# EAGLE design HF091CBU (EAGLE 9.6.1)

## Sheet 1 of 2
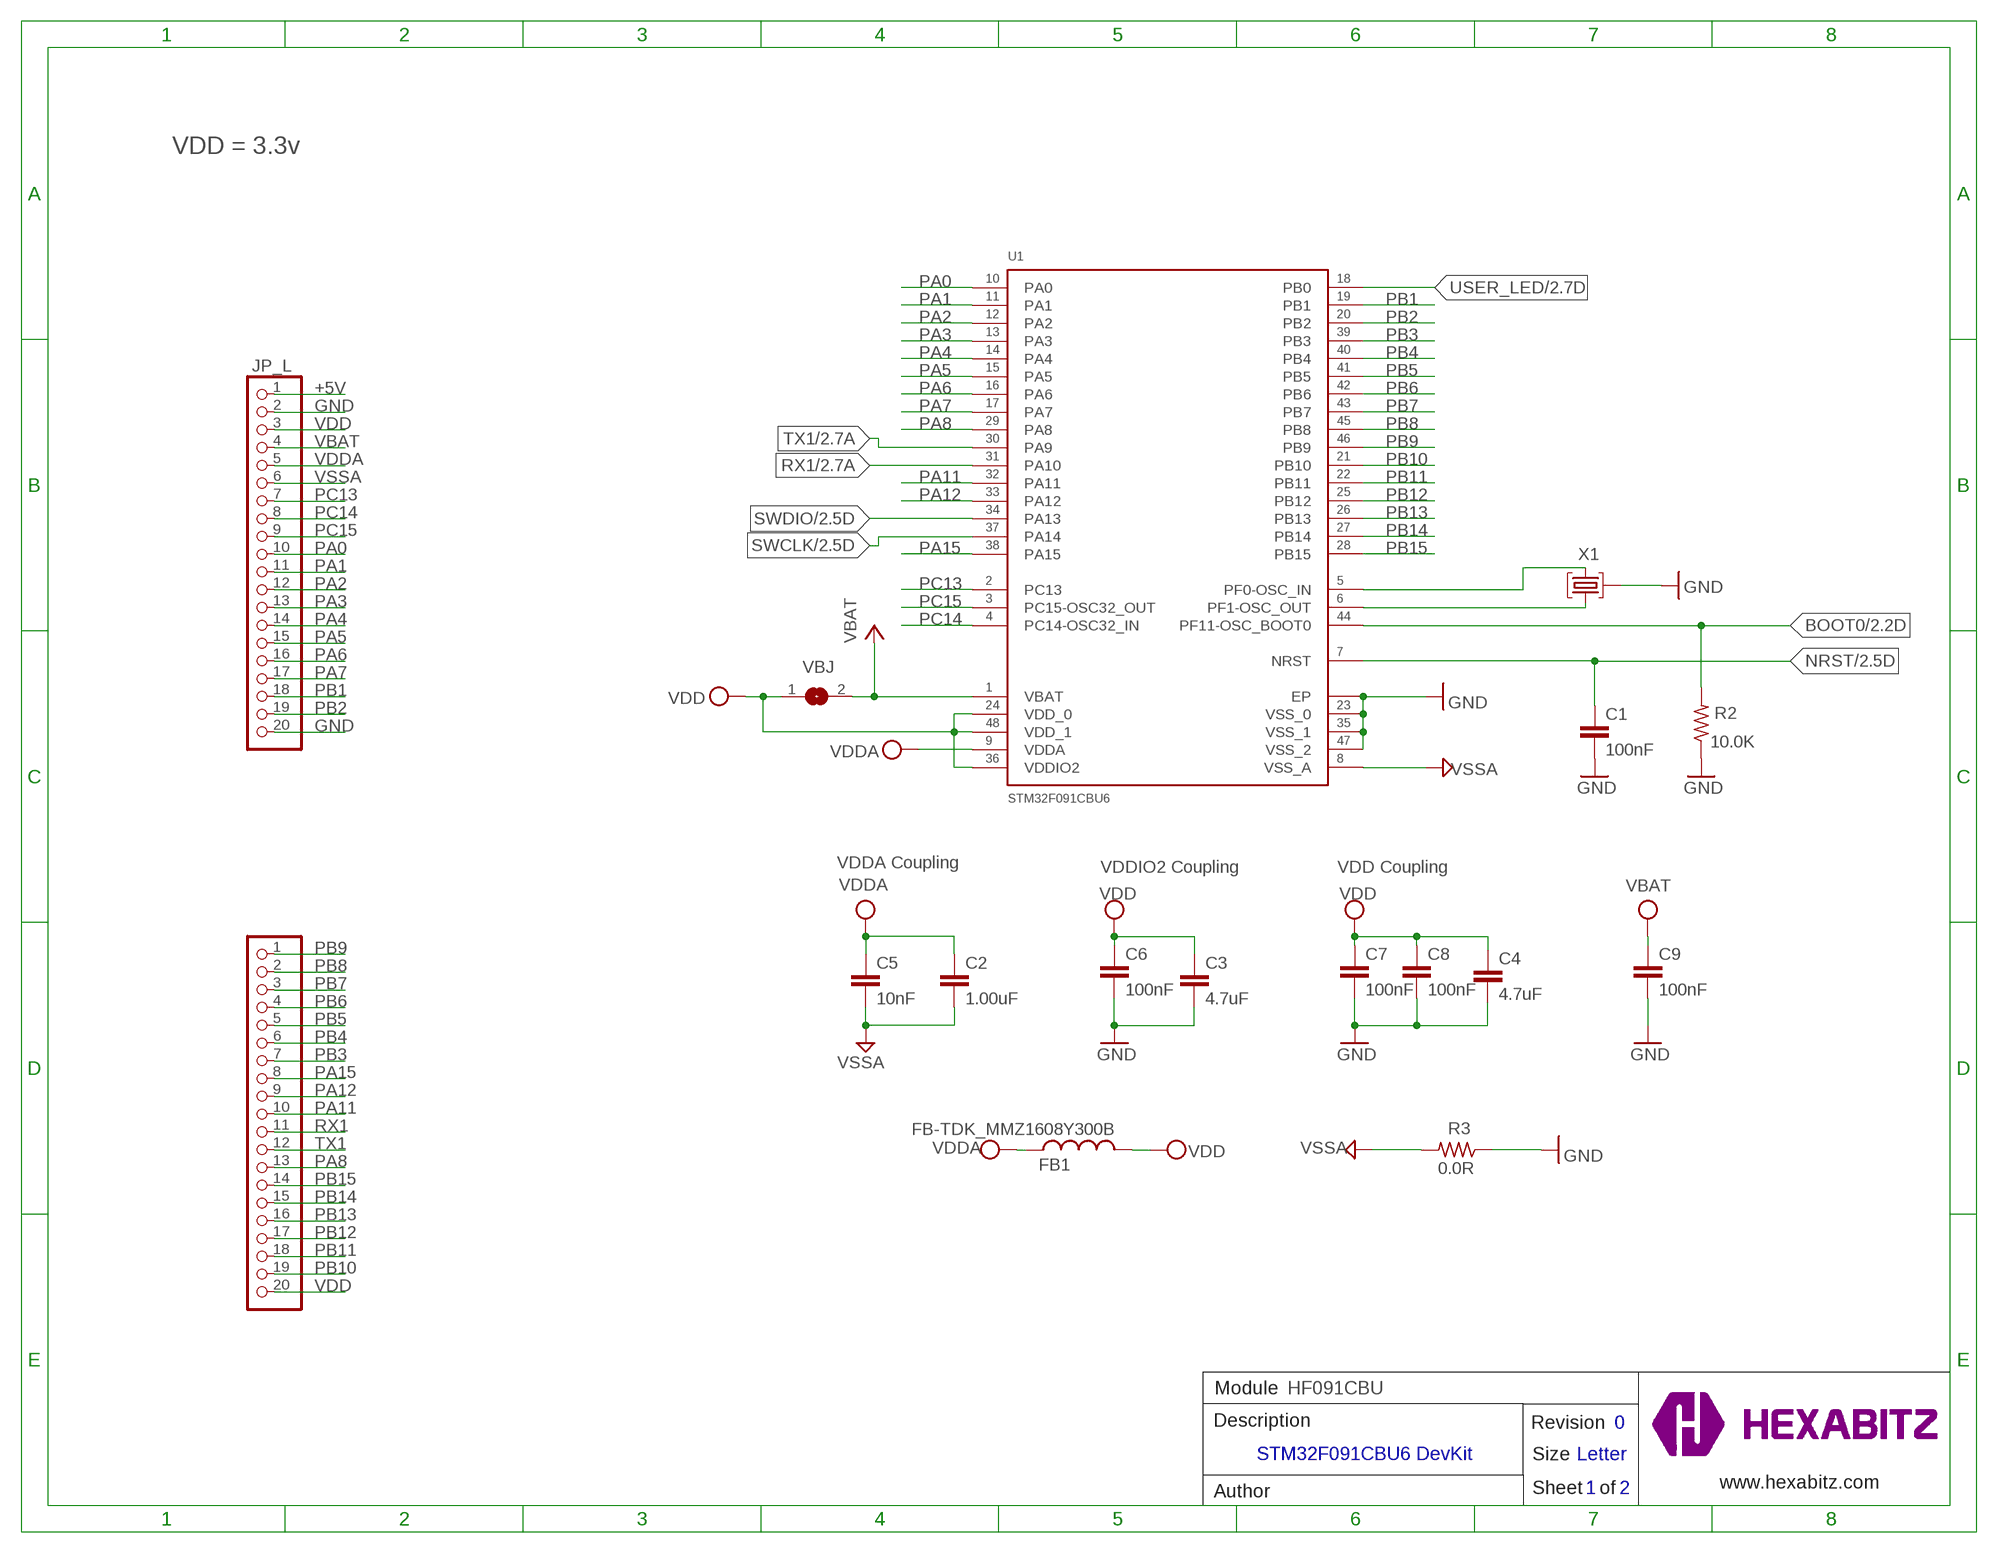
[diagram p0: schematic, sheet 1]

### Parts
C1  100nF  C-0603  [C-0603]
C2  1.00uF  C-0805  [C-0805]
C3  4.7uF  C-0805  [C-0805]
C4  4.7uF  C-0805  [C-0805]
C5  10nF  C-0603  [C-0603]
C6  100nF  C-0603  [C-0603]
C7  100nF  C-0603  [C-0603]
C8  100nF  C-0603  [C-0603]
C9  100nF  C-0603  [C-0603]
FB1  FB-TDK_MMZ1608Y300B  FB-0603  [FB-0603]
JP_L  PINHD-1X20  [1X20]
JP_R  PINHD-1X20  [1X20]
R2  10.0K  R-0603  [R-0603]
R3  0.0R  R-0603  [R-0603]
U1  STM32F091CBU6  [STM32F091CBU6]
VBJ  SJ  [SJ]
X1  XTALL_CSTCE8M00G52  [XTALL_CSTCE8M00G52]

### Nets
+5V: JP_L.1 ; also sheet 2
BOOT0: R2.2 U1.P$44(PF11-OSC_BOOT0) ; also sheet 2
GND: C1.2 C3.2 C4.2 C6.2 C7.2 C8.2 C9.2 JP_L.2 JP_L.20 R2.1 R3.1 U1.EP U1.P$23(VSS_0) U1.P$35(VSS_1) U1.P$47(VSS_2) X1.P$2 ; also sheet 2
N$5: U1.P$5(PF0-OSC_IN) X1.P$1
N$6: U1.P$6(PF1-OSC_OUT) X1.P$3
NRST: C1.1 U1.P$7(NRST) ; also sheet 2
PA0: JP_L.10 U1.P$10(PA0)
PA1: JP_L.11 U1.P$11(PA1)
PA2: JP_L.12 U1.P$12(PA2)
PA3: JP_L.13 U1.P$13(PA3)
PA4: JP_L.14 U1.P$14(PA4)
PA5: JP_L.15 U1.P$15(PA5)
PA6: JP_L.16 U1.P$16(PA6)
PA7: JP_L.17 U1.P$17(PA7)
PA8: JP_R.13 U1.P$29(PA8)
PA11: JP_R.10 U1.P$32(PA11)
PA12: JP_R.9 U1.P$33(PA12)
PA15: JP_R.8 U1.P$38(PA15)
PB1: JP_L.18 U1.P$19(PB1)
PB2: JP_L.19 U1.P$20(PB2)
PB3: JP_R.7 U1.P$39(PB3)
PB4: JP_R.6 U1.P$40(PB4)
PB5: JP_R.5 U1.P$41(PB5)
PB6: JP_R.4 U1.P$42(PB6)
PB7: JP_R.3 U1.P$43(PB7)
PB8: JP_R.2 U1.P$45(PB8)
PB9: JP_R.1 U1.P$46(PB9)
PB10: JP_R.19 U1.P$21(PB10)
PB11: JP_R.18 U1.P$22(PB11)
PB12: JP_R.17 U1.P$25(PB12)
PB13: JP_R.16 U1.P$26(PB13)
PB14: JP_R.15 U1.P$27(PB14)
PB15: JP_R.14 U1.P$28(PB15)
PC13: JP_L.7 U1.P$2(PC13)
PC14: JP_L.8 U1.P$3(PC14-OSC32_IN)
PC15: JP_L.9 U1.P$4(PC15-OSC32_OUT)
RX1: JP_R.11 U1.P$31(PA10) ; also sheet 2
SWCLK: U1.P$37(PA14) ; also sheet 2
SWDIO: U1.P$34(PA13) ; also sheet 2
TX1: JP_R.12 U1.P$30(PA9) ; also sheet 2
USER_LED: U1.P$18(PB0) ; also sheet 2
VBAT: C9.1 JP_L.4 U1.P$1(VBAT) VBJ.2 ; supply symbol labelled VDDA
VDD: C3.1 C4.1 C6.1 C7.1 C8.1 FB1.2 JP_L.3 JP_R.20 U1.P$24(VDD_0) U1.P$36(VDDIO2) U1.P$48(VDD_1) VBJ.1 ; also sheet 2
VDDA: C2.1 C5.1 FB1.1 JP_L.5 U1.P$9(VDDA)
VSSA: C2.2 C5.2 JP_L.6 R3.2 U1.P$8(VSS_A)

### Notes on the sheet
- VDD = 3.3v
- VDDA Coupling | VDDIO2 Coupling | VDD Coupling
- Module | HF091CBU
- Description | Revision | 0
- STM32F091CBU6 DevKit
- Size | Letter
- www.hexabitz.com
- Author | Sheet   of | 1 | 2
- C:/Users/Admin/Desktop/logodraft.bmp

## Sheet 2 of 2
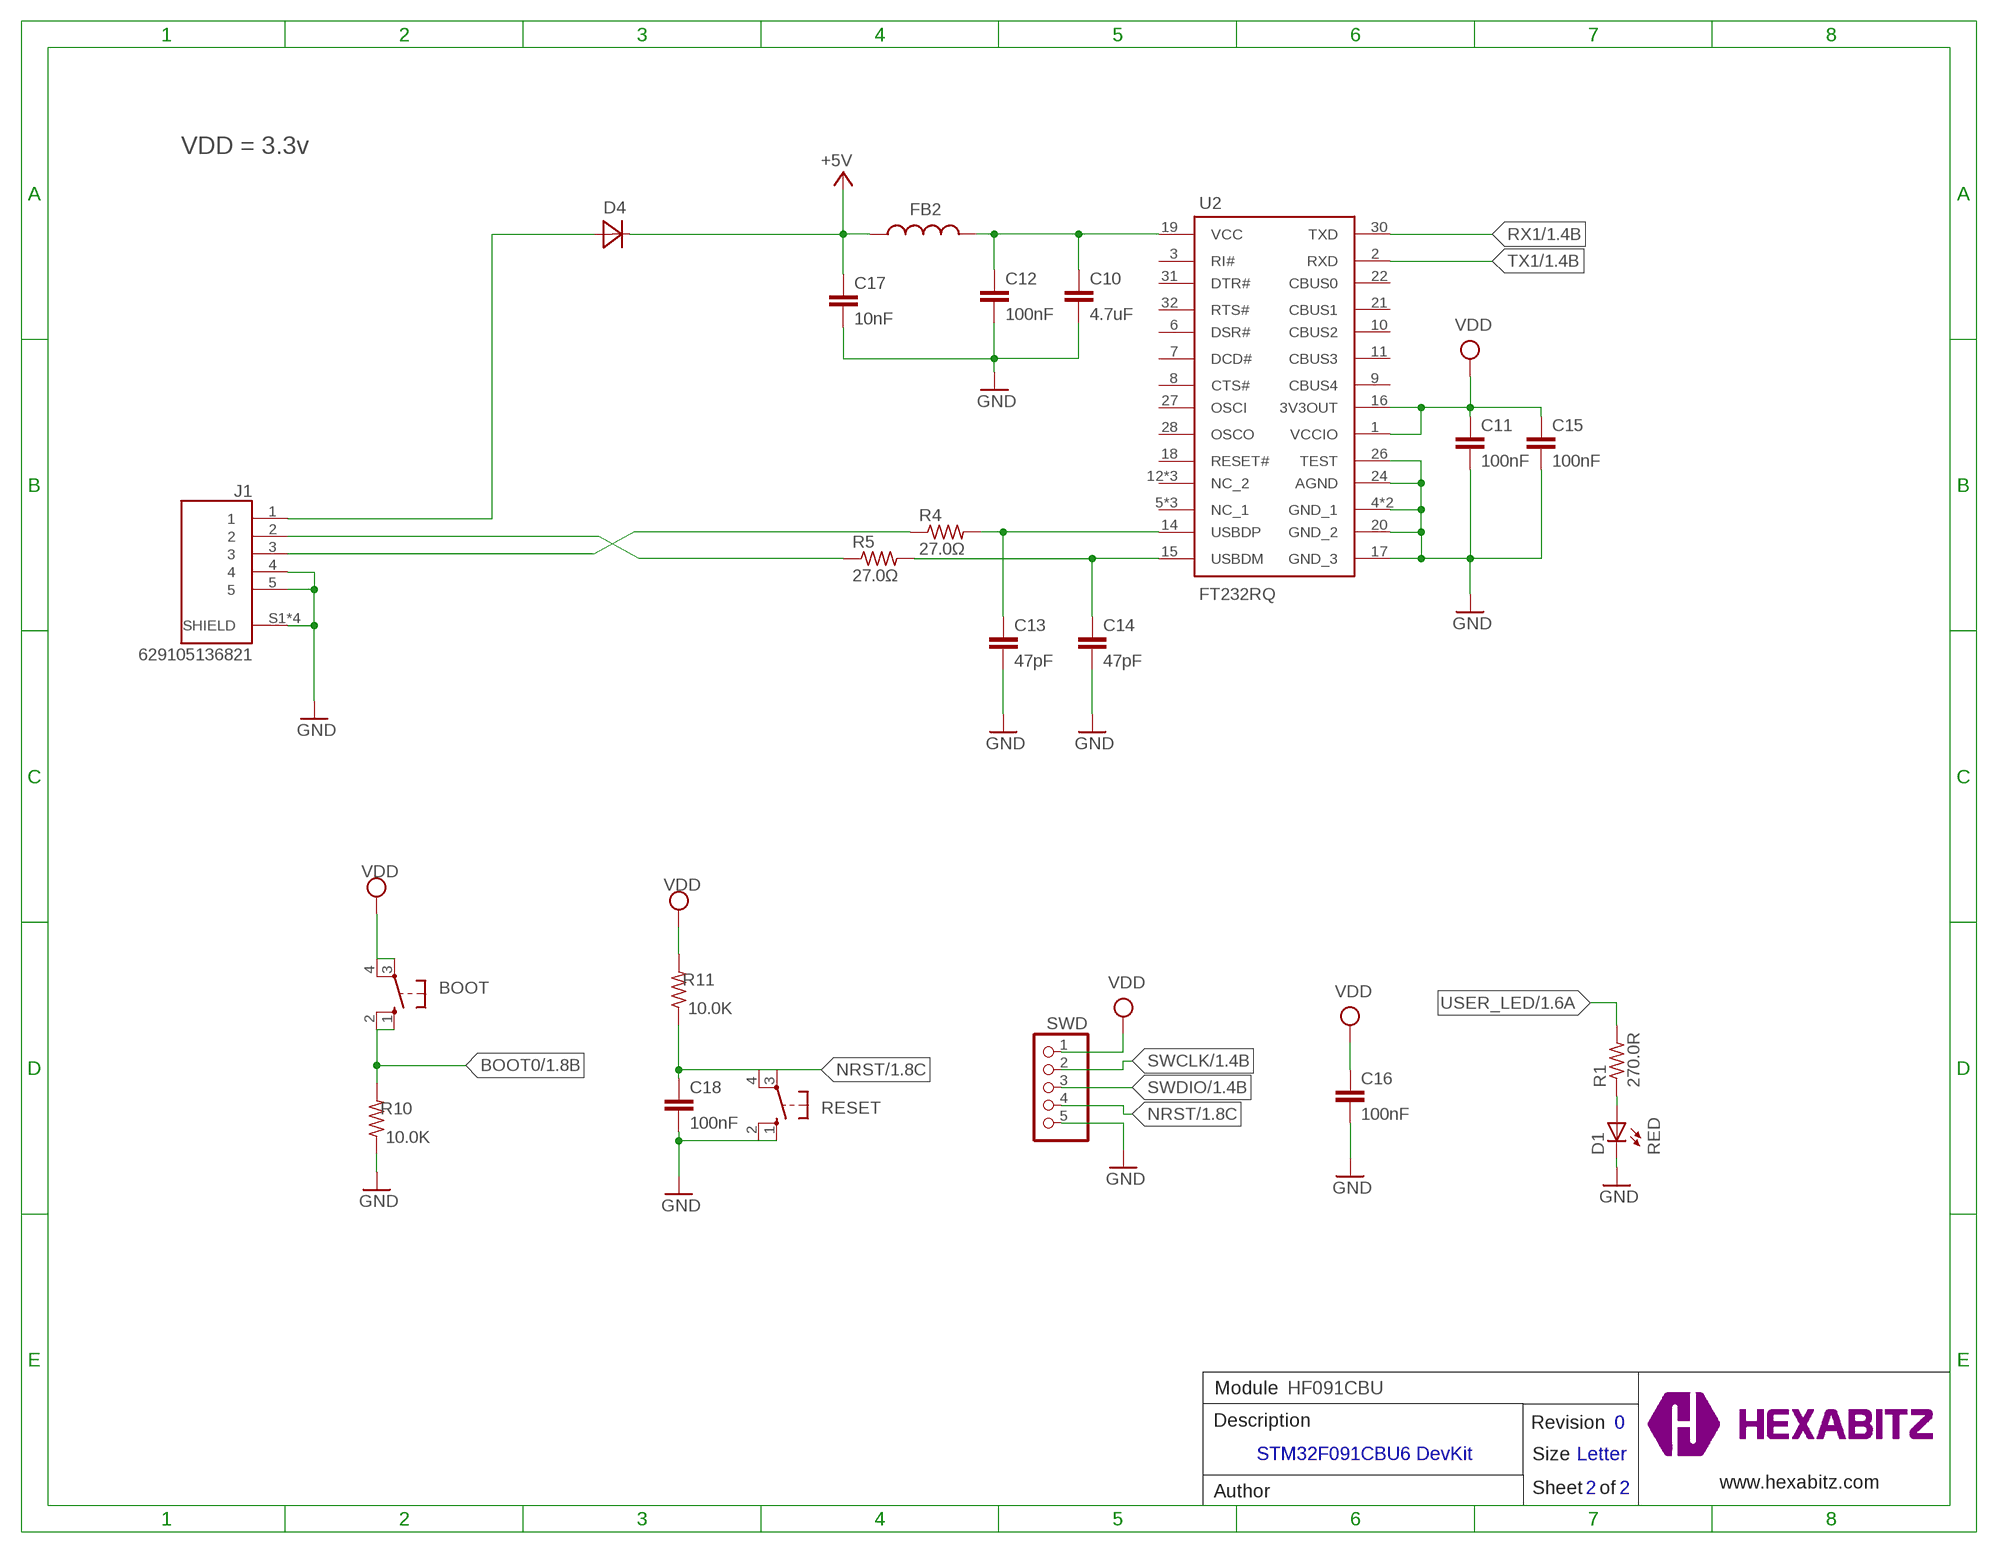
[diagram p1: schematic, sheet 2]

### Parts
BOOT  10-XX  [B3F-10XX]
C10  4.7uF  C-0805  [C-0805]
C11  100nF  C-0603  [C-0603]
C12  100nF  C-0603  [C-0603]
C13  47pF  C-0603  [C-0603]
C14  47pF  C-0603  [C-0603]
C15  100nF  C-0603  [C-0603]
C16  100nF  C-0603  [C-0603]
C17  10nF  C-0603  [C-0603]
C18  100nF  C-0603  [C-0603]
D1  RED  VLMS1300-GS08  [VLMS1300-GS08]
D4  DIOD-SOD-123  [SOD123]
FB2  FB-TDK_MMZ1608Y300B  FB-0603  [FB-0603]
J1  629105136821  [WE_629105136821]
R1  270.0R  R-0603  [R-0603]
R4  27.0Ω  R-0603  [R-0603]
R5  27.0Ω  R-0603  [R-0603]
R10  10.0K  R-0603  [R-0603]
R11  10.0K  R-0603  [R-0603]
RESET  10-XX  [B3F-10XX]
SWD  PINHD-1X5/90  [1X05/90]
TRIMBLE-LOGO1  HEXABITZ-LOGO_NO_BOTTOM_SPLIT  [HEXABITZ-LOGO_NO_BOTTOM_SPLIT]
U2  FT232RQ  [QFN50P500X500X90-33N]

### Nets
+5V: C17.1 D4.2(C) FB2.1 ; also sheet 1
BOOT0: BOOT.1(S) BOOT.2(S1) R10.2 ; also sheet 1
GND: C10.2 C11.2 C12.2 C13.2 C14.2 C15.2 C16.2 C17.2 C18.2 D1.C J1.4 J1.5 J1.S1(SHIELD) J1.S2(SHIELD) J1.S3(SHIELD) J1.S4(SHIELD) R10.1 RESET.1(S) RESET.2(S1) SWD.5 U2.4(GND_1) U2.17(GND_3) U2.20(GND_2) U2.24(AGND) U2.26(TEST) U2.33(GND_1) ; also sheet 1
N$1: D4.1(A) J1.1
N$2: C10.1 C12.1 FB2.2 U2.19(VCC)
N$4: D1.A R1.1
NRST: C18.1 R11.1 RESET.3(P) RESET.4(P1) SWD.4 ; also sheet 1
RX1: U2.30(TXD) ; also sheet 1
SWCLK: SWD.2 ; also sheet 1
SWDIO: SWD.3 ; also sheet 1
TX1: U2.2(RXD) ; also sheet 1
USB_N: J1.2 R5.1
USB_P: J1.3 R4.1
USBD_N: C14.1 R5.2 U2.15(USBDM)
USBD_P: C13.1 R4.2 U2.14(USBDP)
USER_LED: R1.2 ; also sheet 1
VDD: BOOT.3(P) BOOT.4(P1) C11.1 C15.1 C16.1 R11.2 SWD.1 U2.1(VCCIO) U2.16(3V3OUT) ; also sheet 1
Unconnected: U2.3(RI#) U2.5(NC_1) U2.6(DSR#) U2.7(DCD#) U2.8(CTS#) U2.9(CBUS4) U2.10(CBUS2) U2.11(CBUS3) U2.12(NC_2) U2.13(NC_2) U2.18(RESET#) U2.21(CBUS1) U2.22(CBUS0) U2.23(NC_1) U2.25(NC_1) U2.27(OSCI) U2.28(OSCO) U2.29(NC_2) U2.31(DTR#) U2.32(RTS#)

### Notes on the sheet
- VDD = 3.3v
- Module | HF091CBU
- Description | Revision | 0
- STM32F091CBU6 DevKit
- Size | Letter
- www.hexabitz.com
- Author | Sheet   of | 2 | 2

## Library data of the parts
BOOT RESET = switch-omron:10-XX: OMRON SWITCH; MPN: B3F-1000; OC_FARNELL: 176432; OC_NEWARK: 36M3542
C1 C6 C8 C16 C18 = HEXABITZ_RCLS:C-0603: CAP CER 10% X7R 0603; CAPACITANCE: 100nF; MFN: KEMET; MPN: C0603C104K8RACTU; OCTOPART_URL: https://octopart.com/c0603c104k8ractu-kemet-145075?r=sp&s=9bS9ASSwSEqMCE9KBEQZ0g; TOLERANCE: 10%; VOLTAGE_RATING: 10V
C2-C4 C10 = HEXABITZ_RCLS:C-0805: CAP CER 10% X7R 0805
C5 = HEXABITZ_RCLS:C-0603: CAP CER 10% X7R 0603; CAPACITANCE: 10nF; MFN: KEMET; MPN: C0603C103K5RACTU; OCTOPART_URL: https://octopart.com/c0603c103k5ractu-kemet-133094?r=sp&s=R_iPBxLnSmGqhkU2rIMFpg; TOLERANCE: 10%; VOLTAGE_RATING: 50V
C7 = HEXABITZ_RCLS:C-0603: CAP CER 10% X7R 0603; CAPACITANCE: 100nF; MFN: KEMET; MPN: C0603C104K8RACTU; OCTOPART_URL: https://octopart.com/c0603c104k8ractu-kemet-145075?r=sp&s=9bS9ASSwSEqMCE9KBEQZ0g; TOLERANCE: 10%; VOLTAGE_RATING: 10
C9 = HEXABITZ_RCLS:C-0603: CAP CER 10% X7R 0603; CAPACITANCE: 100nF; MFN: KEMET; MPN: C0603C104K8RACTU; OCTOPART_URL: https://octopart.com/c0603c104k8ractu-kemet-145075?r=sp&s=9bS9ASSwSEqMCE9KBEQZ0g; TOLERANCE: 10V; VOLTAGE_RATING: 10%
C11 C12 C15 C17 = HEXABITZ_RCLS:C-0603: CAP CER 10% X7R 0603; CAPACITANCE: 100 nF; MFN: AVX; MPN: 0603YC104K4T2A; OCTOPART_URL: https://octopart.com/0603yc104k4t2a-avx+interconnect+%2F+elco-8120651; TOLERANCE: ±10%; VOLTAGE_RATING: 16.0 V
C13 = HEXABITZ_RCLS:C-0603: CAP CER 10% X7R 0603; CAPACITANCE: 47 pF; MFN: AVX; MPN: 06035A470JAT2A; OCTOPART_URL: https://octopart.com/c3225x5r0j107m250ac-tdk-25947844?r=spc#; TOLERANCE: ±5%; VOLTAGE_RATING: 50.0 V
C14 = HEXABITZ_RCLS:C-0603: CAP CER 10% X7R 0603; CAPACITANCE: 47 pF; MFN: AVX; MPN: 06035A470JAT2A; OCTOPART_URL: https://octopart.com/06035a470jat2a-avx+interconnect+%2F+elco-46507018; TOLERANCE: ±5%; VOLTAGE_RATING: 50.0 V
D1 = Hexabitz:VLMS1300-GS08: Red 0603 130° Clear 54 mcd 2 V Surface Mount ChipLED ; Octopart Url : http://octopart.com/vlms1300-gs08-vishay-21709201; MFN: Vishay; MPN: VLMS1300-GS08; OCTOPART_URL: https://octopart.com/vlms1300-gs08-vishay-21709201?r=sp&s=_gcP4_q8T1SC6PJQPTQ9yA
D4 = HEXABITZ_RCLS:DIOD-SOD-123: 1.0 A Surface Mount Schottky Barrier Rectifier, 40 V, -65 to 125 degC, 2-Pin SOD-123 Package, RoHS, Tape and Reel
FB1 FB2 = HEXABITZ_RCLS:FB-0603: Ferrite Beads Multi-Layer 0603; MFN: TDK; MPN: MMZ1608Y300B; OCTOPART_URL: https://octopart.com/mmz1608y300b-tdk-368280?r=sp&s=cd9_2ZEqQ9q9UNBuQgHAiA
J1 = HEXABITZ_CONNECTION_PARTS:629105136821: WR-COM SMT Horizontal 5 Contacts Micro USB Type B,5 pins Check availability <https://pricing.snapeda.com/parts/629105136821/W%C3%BCrth%20Elektronik/view-part?ref=eda>; AVAILABILITY: In Stock; DESCRIPTION: USB - micro B USB 2.0 Receptacle Connector 5 Position Surface Mount, Right Angle; MF: Würth Elektronik; MP: 629105136821; PACKAGE: None; PRICE: None; PURCHASE-URL: https://pricing.snapeda.com/search/part/629105136821/?ref=eda
JP_L JP_R = HEXABITZ_USER_INTERFACE_PARTS:PINHD-1X20: PIN HEADER
R1 = HEXABITZ_RCLS:R-0603: Thick Film Resistors - SMD 0603; MFN: Yageo; MPN: RC0603FR-07270RL; OCTOPART_URL: https://octopart.com/search?q=RC0603FR-07270RL&start=0; RESISTANCE: 270.0 Ohm; TOLERANCE: 1%
R2 = HEXABITZ_RCLS:R-0603: Thick Film Resistors - SMD 0603; MFN: Vishay; MPN: CRCW060310K0JNEB; OCTOPART_URL: https://octopart.com/crcw060310k0jneb-vishay+dale-46603268; RESISTANCE: 10.0K Ohm; TOLERANCE: 5%
R3 = HEXABITZ_RCLS:R-0603: Thick Film Resistors - SMD 0603; MFN: Yageo; MPN: RC0603JR-070RL; OCTOPART_URL: https://octopart.com/rc0603jr-070rl-yageo-1241539?r=sp&s=X2NteqRjRNWrnx42Y0aliA
R4 R5 = HEXABITZ_RCLS:R-0603: Thick Film Resistors - SMD 0603; MFN: Vishay; MPN: CRCW060327R0FKEA; OCTOPART_URL: https://octopart.com/crcw060327r0fkea-vishay-39833156; RESISTANCE: 27.0 Ω; TOLERANCE: ±1%
R10 R11 = HEXABITZ_RCLS:R-0603: Thick Film Resistors - SMD 0603; MFN: Yageo; MPN: RC0603JR-0710KL; OCTOPART_URL: https://octopart.com/search?q=RC0603JR-0710KL&start=0; RESISTANCE: 10.0K Ohm; TOLERANCE: 5%
SWD = HEXABITZ_USER_INTERFACE_PARTS:PINHD-1X5: PIN HEADER
TRIMBLE-LOGO1 = HEXABITZ_USER_INTERFACE_PARTS:HEXABITZ-LOGO_NO_BOTTOM_SPLIT: Trimble-Logo
U1 = Hexabitz:STM32F091CBU6: Description : ARM-based 32-bit MCU, CAN, 12 timers, ADC, DAC & Comm. Interface, 2 to 3.6 V, -40 to 85 degC, 48-Pin UFQFPN, RoHS, Tray ;Parameter : Ciiva URL : https://ciiva.com/part/STM32F091CBU6-20240708, CiivaID : 20240708, Clock Speed : 48000000.0 Hz, Lifecycle Status : Active, Mounting Style : Surface Mount, Number of Pins : 48, Octopart Url : https://octopart.com/stm32f091cbu6-stmicroelectronics-51988677, OctopartID : 5f4f955c32ec8088, RAM Memory Size : 32768 B, REACH SVHC Compliance : No SVHC, RoHS : Compliant,; MFN: STMicroelectronics; MPN: STM32F091CBU6; OCTOPART_URL: https://octopart.com/stm32f091cbu6-stmicroelectronics-51988677?r=sp&s=bU6fpgsrTZOxHyt7jkfh3w
U2 = HEXABITZ_ICs:FT232RQ: USB-to-UART 1-CH 256Byte FIFO 5V 32-Pin QFN EP Check availability <https://pricing.snapeda.com/parts/FT232RQ/FTDI%2C%20Future/view-part?ref=eda> Check availability <https://pricing.snapeda.com/parts/FT232RQ/FTDI%2C%20Future/view-part?ref=eda>; AVAILABILITY: In Stock; CHECK_PRICES: https://www.snapeda.com/parts/FT232RQ/FTDI%252C+Future+Technology+Devices+International+Ltd/view-part/?ref=eda; DESCRIPTION: USB Bridge, USB to UART USB 2.0 UART Interface 32-QFN (5x5); MF: FTDI, Future; MP: FT232RQ; PACKAGE: QFN-32 FTDI; PRICE: None; SNAPEDA_LINK: https://www.snapeda.com/parts/FT232RQ/FTDI%252C+Future+Technology+Devices+International+Ltd/view-part/?ref=snap
VBJ = jumper:SJ: SMD solder JUMPER
X1 = Hexabitz:XTALL_CSTCE8M00G52: MURATA CSTCE8M00G52-R0 RESONATOR, SMD, 8MHZ ; Octopart Url : https://octopart.com/cstce8m00g52-r0-murata-7145559; MFN: Murata; MPN: CSTCE8M00G52Z-R0; OCTOPART_URL: https://octopart.com/cstce8m00g52z-r0-murata-17755941?r=sp&s=JDnNJnrHQhyS8Zk4ofFWXw

## Board
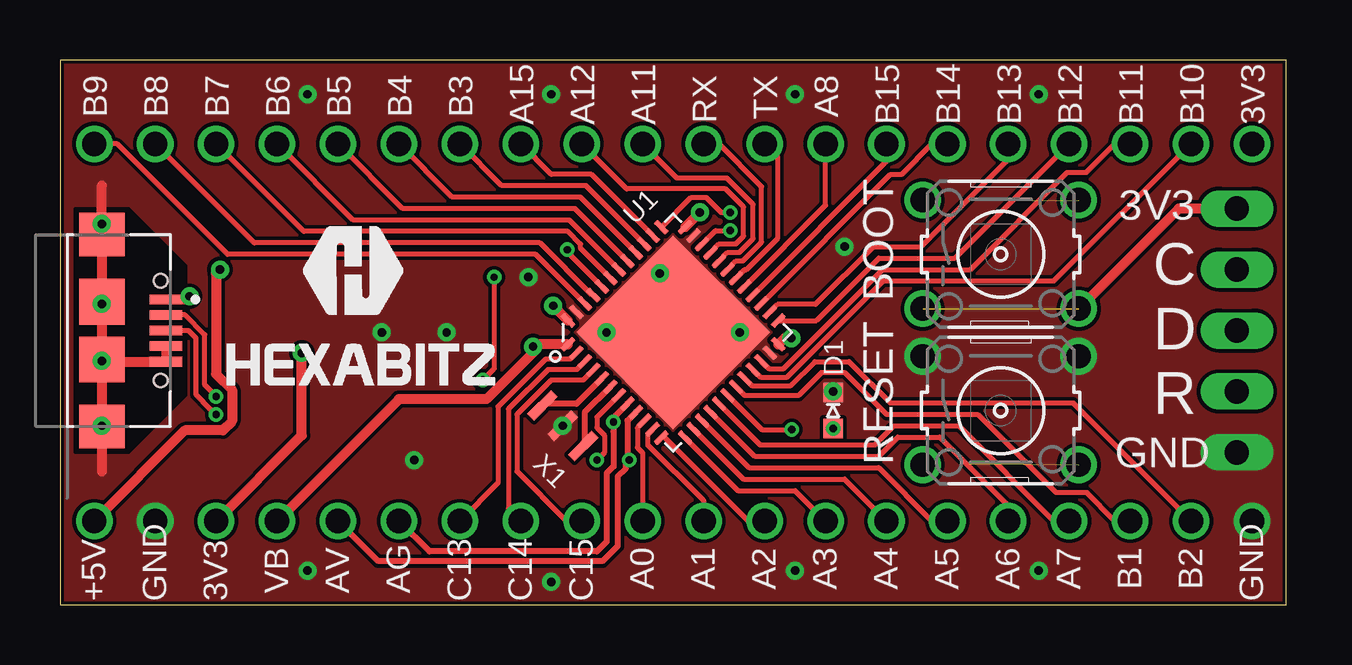
[diagram p2: board, top side]
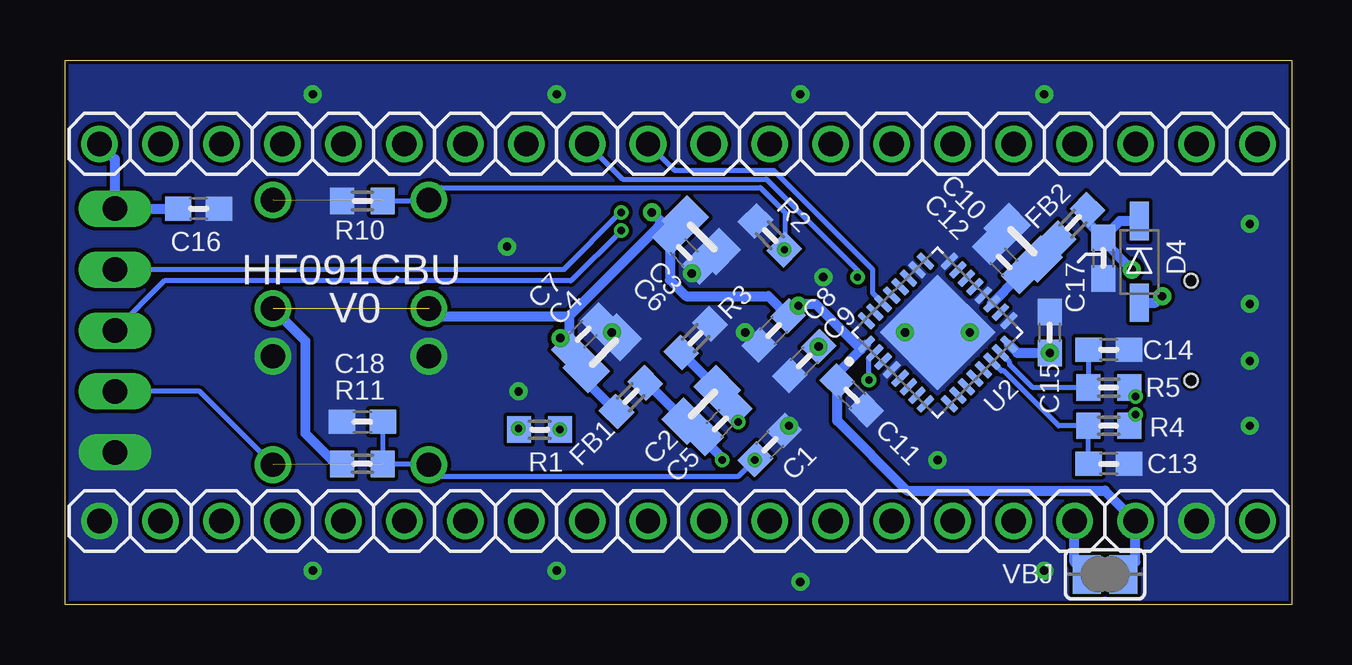
[diagram p3: board, bottom side, seen from below]

Size 51.12 x 22.7 mm. Coordinates in mm from the lower left corner, seen from the top.
Outline: 0,22.7 0,0 51.12,0 51.12,22.7 0,22.7
Copper layers (1*16): Top 0.035mm / dielectric 1.5mm / Bottom 0.035mm
Design rules "2_layer *": minimum track width 7mil, minimum drill 0.006453125mm, track to track 6mil, track to pad 6mil, pad to pad 6mil, via to via 6mil, smd to smd 0mil, copper to edge 0.15mm, drill to drill 8mil, minimum pad ring 10mil, minimum via ring 6mil, stop-mask expansion 2mil, vias tented up to drill 15mil, thermal gap 10mil

### Footprints (pad centres in the part's own frame; a part is rotated, then mirrored left to right if it is on the bottom)
B3F-10XX = drill 1.016: 1 -3.251,2.261; 2 3.251,2.261; 3 -3.251,-2.261; 4 3.251,-2.261
C-0603 = smd 1.1 x 1: 1 -0.85,0; 2 0.85,0
C-0805 = smd 1.3 x 1.5: 1 -0.95,0; 2 0.95,0
VLMS1300-GS08 = smd 0.8 x 0.8: A 0,0.75; C 0,-0.75
SOD123 = smd 1.6 x 0.8: 1 -1.7,0; 2 1.7,0
FB-0603 = smd 1 x 1.1: 1 -0.85,0; 2 0.85,0
WE_629105136821 = smd 0.4 x 1.35: 1 -1.3,2.675; 2 -0.65,2.675; 3 0,2.675; 4 0.65,2.675; 5 1.3,2.675 | smd 1.8 x 1.9: S1 -4,0; S4 4,0 | smd 1.9 x 1.9: S2 -1.2,0; S3 1.2,0 | hole 0.55: -2.075,2.45; 2.075,2.45
1X20 = drill 1.016: 1 -24.13,0; 2 -21.59,0; 3 -19.05,0; 4 -16.51,0; 5 -13.97,0; 6 -11.43,0; 7 -8.89,0; 8 -6.35,0; 9 -3.81,0; 10 -1.27,0; 11 1.27,0; 12 3.81,0; 13 6.35,0; 14 8.89,0; 15 11.43,0; 16 13.97,0; 17 16.51,0; 18 19.05,0; 19 21.59,0; 20 24.13,0
R-0603 = smd 1 x 1.1: 1 -0.85,0; 2 0.85,0
1X05/90 = drill 1.016 long: 1 -5.08,-3.81; 2 -2.54,-3.81; 3 0,-3.81; 4 2.54,-3.81; 5 5.08,-3.81
STM32F091CBU6 = smd 5.7 x 5.7: EP 0,0 | smd 0.25 x 0.7: P$1 -2.75,-3.45; P$2 -2.25,-3.45; P$3 -1.75,-3.45; P$4 -1.25,-3.45; P$5 -0.75,-3.45; P$6 -0.25,-3.45; P$7 0.25,-3.45; P$8 0.75,-3.45; P$9 1.25,-3.45; P$10 1.75,-3.45; P$11 2.25,-3.45; P$12 2.75,-3.45; P$25 2.75,3.45; P$26 2.25,3.45; P$27 1.75,3.45; P$28 1.25,3.45; P$29 0.75,3.45; P$30 0.25,3.45; P$31 -0.25,3.45; P$32 -0.75,3.45; P$33 -1.25,3.45; P$34 -1.75,3.45; P$35 -2.25,3.45; P$36 -2.75,3.45 | smd 0.7 x 0.25: P$13 3.45,-2.75; P$14 3.45,-2.25; P$15 3.45,-1.75; P$16 3.45,-1.25; P$17 3.45,-0.75; P$18 3.45,-0.25; P$19 3.45,0.25; P$20 3.45,0.75; P$21 3.45,1.25; P$22 3.45,1.75; P$23 3.45,2.25; P$24 3.45,2.75; P$37 -3.45,2.75; P$38 -3.45,2.25; P$39 -3.45,1.75; P$40 -3.45,1.25; P$41 -3.45,0.75; P$42 -3.45,0.25; P$43 -3.45,-0.25; P$44 -3.45,-0.75; P$45 -3.45,-1.25; P$46 -3.45,-1.75; P$47 -3.45,-2.25; P$48 -3.45,-2.75
QFN50P500X500X90-33N = smd 0.81 x 0.27: 1 -2.45,1.75; 2 -2.45,1.25; 3 -2.45,0.75; 4 -2.45,0.25; 5 -2.45,-0.25; 6 -2.45,-0.75; 7 -2.45,-1.25; 8 -2.45,-1.75; 17 2.45,-1.75; 18 2.45,-1.25; 19 2.45,-0.75; 20 2.45,-0.25; 21 2.45,0.25; 22 2.45,0.75; 23 2.45,1.25; 24 2.45,1.75 | smd 0.27 x 0.81: 9 -1.75,-2.45; 10 -1.25,-2.45; 11 -0.75,-2.45; 12 -0.25,-2.45; 13 0.25,-2.45; 14 0.75,-2.45; 15 1.25,-2.45; 16 1.75,-2.45; 25 1.75,2.45; 26 1.25,2.45; 27 0.75,2.45; 28 0.25,2.45; 29 -0.25,2.45; 30 -0.75,2.45; 31 -1.25,2.45; 32 -1.75,2.45 | smd 3.4 x 3.4: 33 0,0
SJ = smd 1.168 x 1.6: 1 -0.762,0; 2 0.762,0
XTALL_CSTCE8M00G52 = smd 1.4 x 0.4: P$1 0,1.2; P$2 0,0; P$3 0,-1.2

### Placement (x,y rotation side)
BOOT  39.21,14.61 0 top
C1  21.75,6.67 45 bottom
C2  24.61,8.33 45 bottom
C3  24.61,15.4 315 bottom
C4  28.73,10.48 45 bottom
C5  23.81,7.54 45 bottom
C6  25.32,14.68 315 bottom
C7  29.53,11.27 45 bottom
C8  21.59,11.43 225 bottom
C9  20.32,10.16 225 bottom
C10  11.19,15.08 135 bottom
C11  18.34,8.73 315 bottom
C12  11.99,14.29 135 bottom
C13  7.62,5.87 0 bottom
C14  7.62,10.64 0 bottom
C15  10.08,11.35 90 bottom
C16  45.56,16.51 0 bottom
C17  7.86,14.45 270 bottom
C18  38.73,7.62 180 bottom
D1  32.23,8.1 180 top
D4  6.35,14.29 90 bottom
FB1  27.54,8.65 225 bottom
FB2  9.11,15.88 225 bottom
J1  1.75,11.43 270 top
JP_L  25.56,3.49 0 top
JP_R  25.56,19.21 0 top
R1  31.35,7.3 0 bottom
R2  21.75,15.4 315 bottom
R3  24.84,11.11 225 bottom
R4  7.62,7.46 180 bottom
R5  7.62,9.05 180 bottom
R10  38.73,16.83 0 bottom
R11  38.73,5.87 180 bottom
RESET  39.21,8.1 0 top
SWD  52.86,11.43 270 top
TRIMBLE-LOGO1  12.22,8.89 0 top
U1  25.56,11.35 315 top
U2  14.76,11.35 45 bottom
VBJ  7.78,1.27 180 bottom
X1  20.95,7.46 45 top

### Tracks (layer width: path | path; a pad name or v marks a point on that pad's centre or on a via)
+5V  (via drill 0.35 pad 0.75)
  Top 0.406: v6.67,13.97 6.51,13.81 6.51,9.61 7.17,8.96 7.17,7.65 6.78,7.27 5.2,7.27 JP_L.1
  Bottom 0.406: D4.2 7.17,15.99 C17.1 | FB2.1 8.51,15.95 C17.1 | v6.67,13.97 7.86,15.16 C17.1
BOOT0  (via drill 0.3 pad 0.6)  (1 unrouted)
  Top 0.203: U1.P$44 21.15,14.7 R2.2
  Bottom 0.203: R10.2 36,16.83 BOOT.1 35.44,17.39 22.15,17.39 21.11,16.35 21.11,14.83 R2.2
  other vias: 21.15,14.8
GND  (via drill 0.35 pad 0.75)
  Top 0.406: 1.75,17.46 J1.S1 J1.S2 J1.S3 | J1.S3 J1.S4 1.75,5.56 | J1.4 J1.5 1.85,10.13 J1.S3
  other vias: 20.95,7.46 22.78,11.35 28.34,11.35 25,13.81 32.23,8.89 13.41,11.35 16.11,11.35 14.76,6.03 40.8,21.27 30.64,21.27 20.48,21.27 10.32,21.27 10.32,1.43 20.48,0.95 30.64,1.43 40.8,1.43 19.53,13.65 32.7,14.92 1.75,15.88 1.75,12.54 1.75,10.16 1.75,7.46
  pour Top (no thermals): 0,22.7 51.12,22.7 51.12,0 0,0
  pour Bottom (no thermals): 0,22.7 51.12,22.7 51.12,0 0,0
  cutout Top: 0.63,11.27 0.63,6.35 2.86,6.35 5.24,8.73 5.24,14.13 2.86,16.51 0.63,16.51
N$1  (via drill 0.35 pad 0.75)
  Top 0.406: v5.4,12.86 5.27,12.73 J1.1
  Bottom 0.406: D4.1 5.67,12.59 v5.4,12.86
N$2
  Bottom 0.406: U2.19 11.38,13.67 C12.1 10.66,14.41 10.58,14.41 | 10.58,14.41 C10.1 | FB2.2 10.58,14.41
N$4  (via drill 0.3 pad 0.6)
  Bottom 0.203: R1.1 32.2,7.32 D1.A
  other vias: 32.23,7.35
N$5
  Top 0.254: X1.P$1 20.17,8.38 21.52,8.38 U1.P$5
N$6
  Top 0.254: X1.P$3 21.87,6.68 21.87,8.02 U1.P$6
NRST  (via drill 0.3 pad 0.6)  (1 unrouted)
  Top 0.203: U1.P$7 22.38,7.82 22.38,7.38 22.69,7.07 22.69,6.34 v22.38,6.03
  Bottom 0.203: v22.38,6.03 | C1.1 v22.38,6.03 | RESET.4 45.52,8.89 SWD.4 | C18.1 R11.1 36,5.87 RESET.3 35.48,5.36 23.06,5.36 v22.38,6.03
PA0
  Top 0.203: U1.P$10 24.07,7.37 24.07,6.55 24.29,6.33 JP_L.10
PA1
  Top 0.203: JP_L.11 26.83,4.35 24.5,6.68 24.5,7.1 24.71,7.31 U1.P$11
PA2
  Top 0.203: JP_L.12 28.7,3.49 25.14,7.05 U1.P$12
PA3
  Top 0.203: U1.P$13 28.26,4.76 30.64,4.76 JP_L.13
PA4
  Top 0.203: U1.P$14 28.49,5.24 32.7,5.24 JP_L.14
PA5
  Top 0.203: U1.P$15 28.72,5.71 34.13,5.71 36.35,3.49 JP_L.15
PA6
  Top 0.203: U1.P$16 28.95,6.19 34.13,6.19 34.92,6.99 36.67,6.99 39.53,4.13 JP_L.16
PA7
  Top 0.203: U1.P$17 29.18,6.67 33.97,6.67 34.77,7.46 37.46,7.46 41.43,3.49 JP_L.17
PA8
  Top 0.203: U1.P$29 31.91,16.64 JP_R.13
PA11
  Top 0.203: U1.P$32 27.83,14.68 28.32,14.68 28.89,15.26 28.89,16.69 27.8,17.78 25.72,17.78 JP_R.10
PA12
  Top 0.203: U1.P$33 27.48,15.04 28.17,15.04 28.5,15.36 28.5,16.58 27.74,17.34 23.62,17.34 JP_R.9
PA15
  Top 0.203: U1.P$38 22.15,17.94 20.48,17.94 JP_R.8
PB1
  Top 0.203: JP_L.18 43.97,3.49 42.78,4.68 41.51,4.68 38.26,7.94 34.45,7.94 32.7,9.68 31.75,9.68 30.8,8.73 28.53,8.73 U1.P$19
PB2
  Top 0.203: U1.P$20 28.84,9.13 30.46,9.13 31.46,10.13 32.89,10.13 34.61,8.41 42.23,8.41 JP_L.19
PB3
  Top 0.203: U1.P$39 21.92,17.46 18.41,17.46 JP_R.7
PB4
  Top 0.203: U1.P$40 21.69,16.99 16.35,16.99 JP_R.6
PB5
  Top 0.203: U1.P$41 21.46,16.51 14.29,16.51 JP_R.5
PB6
  Top 0.203: U1.P$42 21.23,16.03 12.22,16.03 JP_R.4
PB7
  Top 0.203: U1.P$43 21.7,14.85 21.7,15.03 21.17,15.56 10.16,15.56 JP_R.3
PB8
  Top 0.203: U1.P$45 22.18,12.91 20,15.08 8.1,15.08 JP_R.2
PB9
  Top 0.203: U1.P$46 19.83,14.61 6.98,14.61 2.38,19.21 JP_R.1
PB10
  Top 0.203: U1.P$21 29.19,9.49 30.31,9.49 34.32,13.49 41.43,13.49 JP_R.19
PB11
  Top 0.203: U1.P$22 29.54,9.84 30.16,9.84 34.29,13.97 37.94,13.97 41.99,18.02 42.78,18.02 43.97,19.21 JP_R.18
PB12
  Top 0.203: U1.P$25 31.53,11.85 34.13,14.45 37.31,14.45 JP_R.17
PB13
  Top 0.203: U1.P$26 29.91,12.52 31.49,12.52 33.9,14.92 35.88,14.92 39.53,18.57 JP_R.16
PB14
  Top 0.203: U1.P$27 34.62,17.94 35.08,17.94 36.35,19.21 JP_R.15
PB15
  Top 0.203: U1.P$28 34.45,18.47 JP_R.14
PC13
  Top 0.203: U1.P$2 21.27,10.24 20.24,10.24 18.26,8.26 18.26,5.08 JP_L.7
PC14
  Top 0.203: U1.P$3 21.54,9.8 20.33,9.8 18.69,8.16 18.69,4.01 JP_L.8
PC15
  Top 0.203: U1.P$4 21.81,9.37 20.48,9.37 19.05,7.94 19.05,5.56 21.11,3.49 JP_L.9
RX1
  Top 0.203: U1.P$31 28.18,14.33 28.46,14.33 29.25,15.11 29.25,17.42 27.46,19.21 JP_R.11
  Bottom 0.203: U2.30 17.46,12.99 17.46,13.97 21.59,18.1 25.72,18.1 JP_R.11 | U2.30
SWCLK  (via drill 0.3 pad 0.6)
  Top 0.203: v27.94,16.35 27.56,16.35 26.93,16.98 26.31,16.98 U1.P$37
  Bottom 0.203: v27.94,16.35 27.97,16.35 30.35,13.97 SWD.2
SWDIO  (via drill 0.3 pad 0.6)
  Top 0.203: U1.P$34 27.33,15.59 v27.94,15.59
  Bottom 0.203: v27.94,15.59 30.04,13.49 46.99,13.49 SWD.3
TX1  (via drill 0.3 pad 0.6)
  Top 0.203: v18.1,13.65 18.1,9.84 v17.62,9.37 | U1.P$30 28.53,13.97 28.61,13.97 29.92,15.28 29.92,18.66 JP_R.12
  Bottom 0.203: v17.62,9.37 17.65,9.37 17.65,10.23 U2.2 | v18.1,13.65 18.1,13.94 21.9,17.74 27.9,17.74 JP_R.12 | U2.2 17.43,10.45 U2.2
USB_N  (via drill 0.3 pad 0.6)
  Top 0.203: v6.51,8.68 6.03,9.16 6.03,11.26 5.21,12.08 J1.2
  Bottom 0.203: R5.1 6.77,8.95 v6.51,8.68
USB_P  (via drill 0.3 pad 0.6)
  Top 0.203: v6.51,7.93 6.31,8.13 6.28,8.13 5.95,8.45 5.95,8.48 5.68,8.76 5.68,11.11 5.36,11.43 J1.3
  Bottom 0.203: v6.51,7.93 6.77,7.67 R4.1
USBD_N
  Bottom 0.203: U2.15 11.75,10.1 11.75,10 10.79,9.05 R5.2 C14.1
USBD_P
  Bottom 0.203: U2.14 12.1,9.75 12,9.75 9.71,7.46 R4.2 C13.1
USER_LED  (via drill 0.3 pad 0.6)
  Top 0.203: U1.P$18 29.25,7.3 R1.2
  other vias: 30.5,7.3
VBAT  (via drill 0.35 pad 0.75)
  Top 0.406: U1.P$1 19.81,10.86 C9.1 19.72,10.51 17.78,8.57 14.13,8.57 JP_L.4
  Bottom 0.406: VBJ.2 9.05,1.78 JP_L.4
  other vias: 19.72,10.76
VDD  (via drill 0.35 pad 0.75)  (1 unrouted)
  Top 0.406: U1.P$48 | U1.P$48 v20.56,12.46 | U1.P$36 v26.67,16.35 | v26.67,16.35 | SWD.1 46.63,16.51 BOOT.4 | v30.48,11.11 30.2,11.11 U1.P$24 | JP_L.3 10.08,7.06 C15.1
  Bottom 0.406: FB1.2 29.41,9.31 C4.1 30.13,10.53 C7.1 | C6.1 26.4,15.76 30.13,12.03 | 30.13,12.03 C7.1 | VBJ.1 6.51,1.78 JP_L.3 7.78,4.76 16.03,4.76 18.94,7.67 C11.1 18.94,9.65 17.95,10.64 | R11.2 39.85,5.87 41.12,7.14 41.12,11 BOOT.4 | 46.41,16.29 C16.1 SWD.1 49.05,18.57 JP_R.20 | BOOT.3 35.64,12.03 30.13,12.03 | C6.1 25.92,15.43 | 25.92,15.43 C3.1 25.16,16.19 | v26.67,16.35 25.92,15.6 25.92,15.43 | C6.1 25.92,13.54 25.24,12.86 21.82,12.86 C8.1 v20.56,12.46 20.48,12.54 19.84,12.54 17.95,10.64 | C7.1 30.48,11.02 v30.48,11.11 | U2.16 11.44,10.5 C15.1 | 17.95,10.64 U2.1 | 17.95,10.64 | C6.1
  other vias: 10.08,10.5
VDDA  (via drill 0.3 pad 0.6)
  Top 0.254: U1.P$9 23.65,7.68 23.65,6.11 v23.73,6.03 23.57,5.87 23.57,5.68 23.25,5.35 23.25,2.45 22.61,1.82 13.26,1.82 JP_L.5
  Bottom 0.406: v23.73,6.03 23.73,6.12 24.55,6.94 | FB1.1 26.87,9.25 24.55,6.94 | 24.55,6.94 C5.1 24.55,6.94 | 24.55,6.94 C2.1
VSSA  (via drill 0.3 pad 0.6)
  Top 0.254: U1.P$8 23.07,7.8 v23.07,7.62 23.07,7.23 23.07,5.77 22.79,5.49 22.79,2.63 22.38,2.22 15.4,2.22 JP_L.6
  Bottom 0.254: v23.07,7.62 23.21,7.76 C5.2
  Bottom 0.406: R3.2 23.97,9.05 23.21,8.28 | 23.21,8.28 | C2.2 23.21,8.28 | 23.21,8.28 C5.2 23.21,8.28

### Text on the board
tPlace: A15 | A12 | A11 | B15 | B14 | B13 | B12 | B11 | B10 | 3V3 | B9 | B8 | B7 | B6 | B5 | B4 | B3 | RX | TX | A8 | 3V3 | C | D | R | GND | A0 | A1 | A2 | A3 | A4 | A5 | A6 | A7 | B1 | B2 | +5V | GND | 3V3 | VB | AV | AG | C13 | C14 | C15 | GND
bNames: HF091CBU | V0